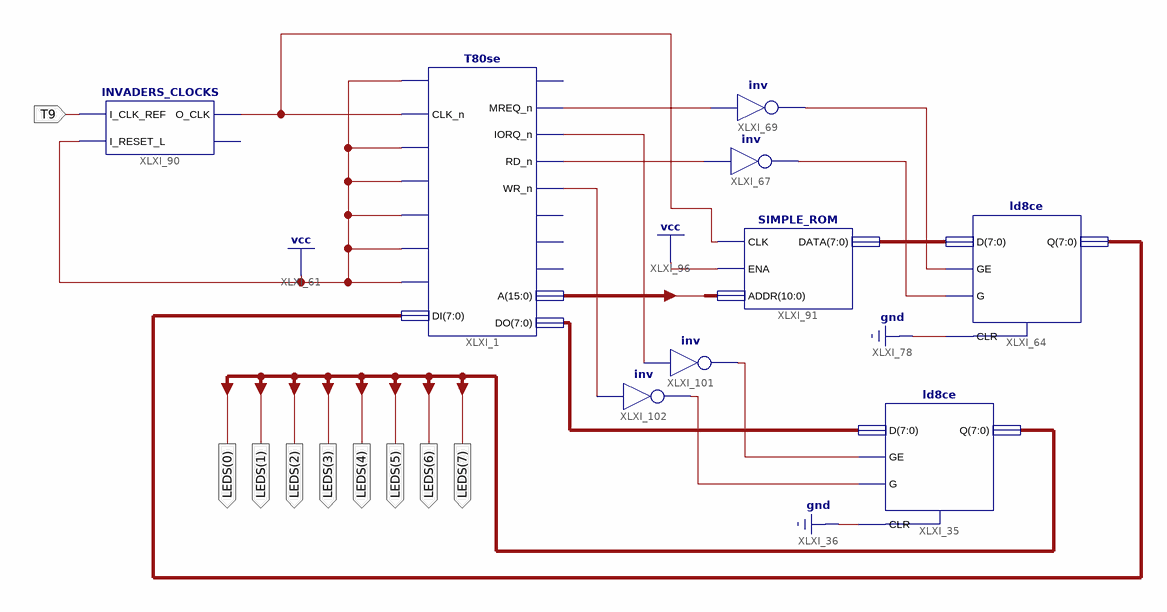
[diagram p0: schematic sheet 1]
// Xilinx ISE schematic z80_clock_rom_invaders.sch (spartan3) as structural Verilog: 9 symbols, 9 ports
module z80_clock_rom_invaders (
  input  T9,
  output [7:0] LEDS
);

  wire XLXN_220, XLXN_221, XLXN_227, XLXN_229, XLXN_230, XLXN_231, XLXN_319, XLXN_321, XLXN_323;
  wire [7:0] XLXN_218, XLXN_222, XLXN_276;
  wire [15:0] ADDRESSES;

  T80se XLXI_1 (
    .RESET_n(1'b1), .CLK_n(XLXN_321), .CLKEN(1'b1), .WAIT_n(1'b1), .INT_n(1'b1), .NMI_n(1'b1),
    .BUSRQ_n(1'b1), .DI(XLXN_276), .MREQ_n(XLXN_231), .IORQ_n(XLXN_220), .RD_n(XLXN_227), .WR_n(XLXN_229),
    .A(ADDRESSES), .DO(XLXN_218));  // open: M1_n, RFSH_n, HALT_n, BUSAK_n
  INVADERS_CLOCKS XLXI_90 (.I_CLK_REF(T9), .I_RESET_L(1'b1), .O_CLK(XLXN_321));  // open: O_CLK_X2
  SIMPLE_ROM XLXI_91 (
    .CLK(XLXN_321), .ENA(1'b1), .ADDR(ADDRESSES[10:0]),
    .DATA({XLXN_222[0], XLXN_222[1], XLXN_222[2], XLXN_222[3], XLXN_222[4], XLXN_222[5], XLXN_222[6], XLXN_222[7]}));
  ld8ce XLXI_64 (
    .CLR(1'b0),
    .D({XLXN_222[0], XLXN_222[1], XLXN_222[2], XLXN_222[3], XLXN_222[4], XLXN_222[5], XLXN_222[6], XLXN_222[7]}),
    .G(XLXN_323), .GE(XLXN_319), .Q(XLXN_276));
  not XLXI_69 (XLXN_319, XLXN_231);
  not XLXI_67 (XLXN_323, XLXN_227);
  not XLXI_101 (XLXN_221, XLXN_220);
  not XLXI_102 (XLXN_230, XLXN_229);
  ld8ce XLXI_35 (.CLR(1'b0), .D(XLXN_218), .G(XLXN_230), .GE(XLXN_221), .Q(LEDS));
endmodule
